# Altium schematic sheet system_electric_diagram_#1.SchDoc
size A4
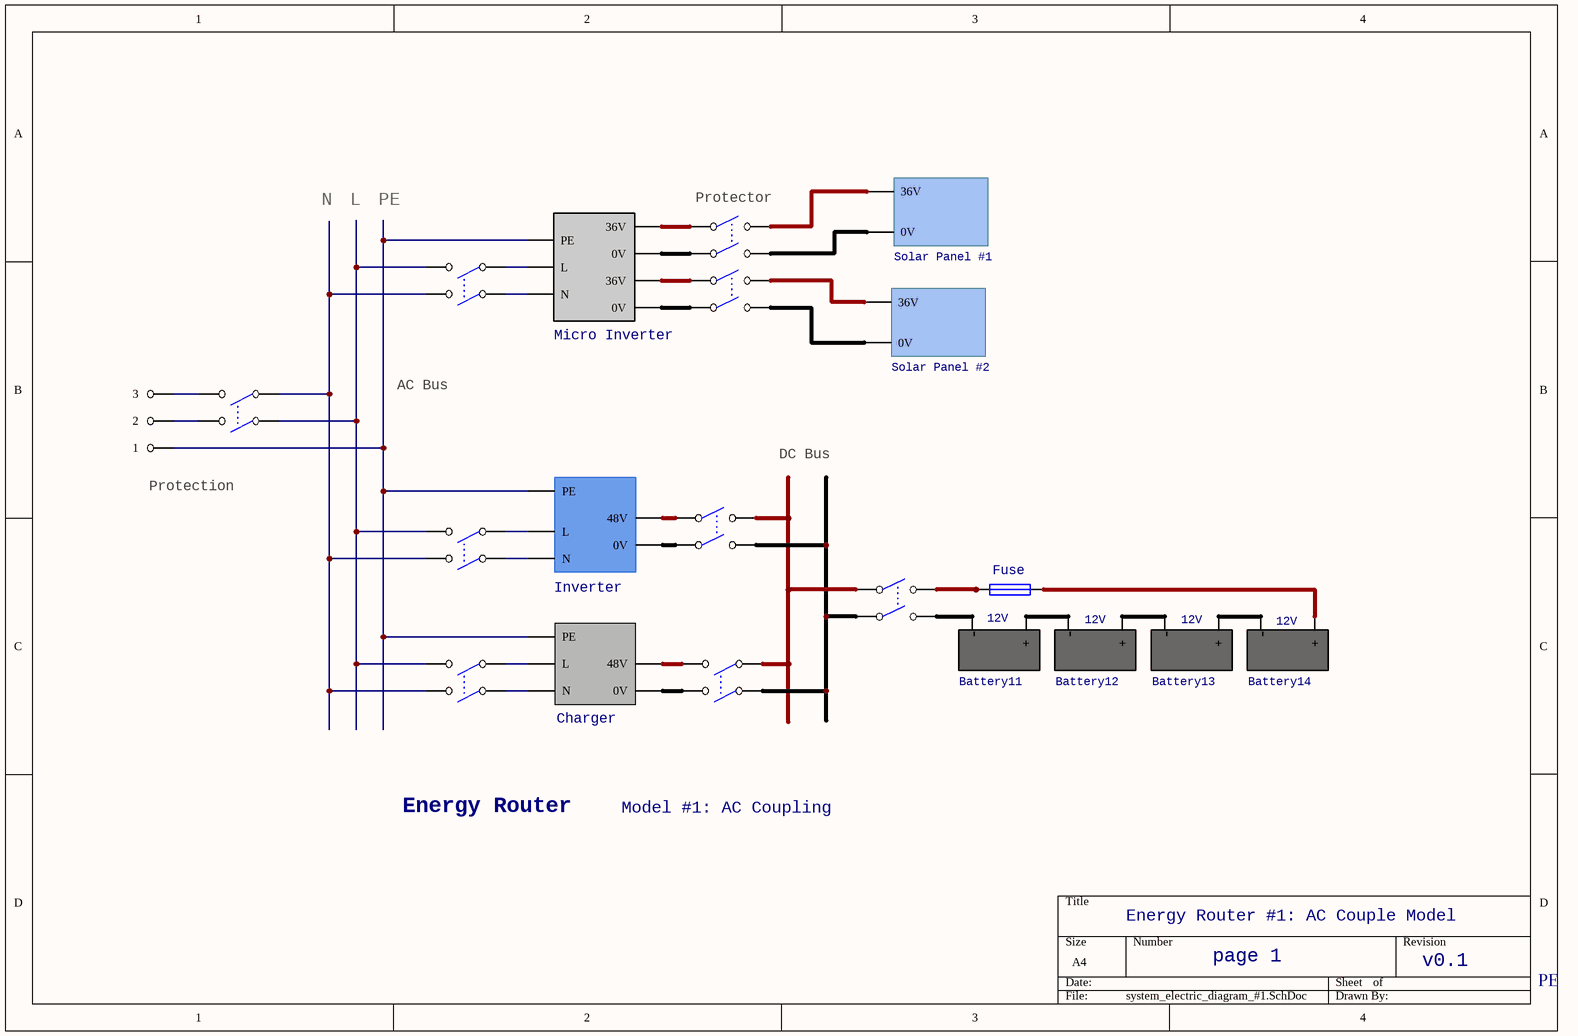
[diagram p0: system_electric_diagram_#1.SchDoc]

## Parts
Battery11  12V
Battery12  12V
Battery13  12V
Battery14  12V
F11  Fuse  [FUSE1]
JP01  3 HEADER  (value not drawn)
K2  Switch  (value not drawn)
K3  Switch  (value not drawn)
K4  Switch  (value not drawn)
K5  Switch  (value not drawn)
K6  Switch  (value not drawn)
K7  Switch  (value not drawn)
K10  Switch  (value not drawn)
K11  Switch  (value not drawn)
K12  Switch  (value not drawn)
U1  Micro Inverter
U2  Inverter
U3  Charger
U4  Solar Panel #1
U5  Solar Panel #2

## Nets
NetBattery11_1: Battery11.1(-) K12.4
NetBattery11_2: Battery11.2(+) Battery12.1(-)
NetBattery12_2: Battery12.2(+) Battery13.1(-)
NetBattery13_2: Battery13.2(+) Battery14.1(-)
NetBattery14_2: Battery14.2(+) F11.2
NetF11_1: F11.1 K12.2
NetJP01_1: JP01.1 U1.3(PE) U2.3(PE) U3.3(PE)
NetJP01_2: JP01.2 K10.2
NetJP01_3: JP01.3 K10.4
NetK2_1: K2.1 U2.1(N)
NetK2_2: K2.2 K3.2 K10.3 K11.2
NetK2_3: K2.3 U2.2(L)
NetK2_4: K2.4 K3.4 K10.1 K11.4
NetK3_1: K3.1 U3.1(N)
NetK3_3: K3.3 U3.2(L)
NetK4_1: K4.1 U1.7(36V)
NetK4_2: K4.2 U4.2(36V)
NetK4_3: K4.3 U1.6(0V)
NetK4_4: K4.4 U4.1(0V)
NetK5_1: K5.1 U1.5(36V)
NetK5_2: K5.2 U5.2(36V)
NetK5_3: K5.3 U1.4(0V)
NetK5_4: K5.4 U5.1(0V)
NetK6_1: K6.1 U2.5(48V)
NetK6_2: K6.2 K7.3 K12.1
NetK6_3: K6.3 U2.4(0V)
NetK6_4: K6.4 K7.1 K12.3
NetK7_2: K7.2 U3.4(0V)
NetK7_4: K7.4 U3.5(48V)
NetK11_1: K11.1 U1.1(N)
NetK11_3: K11.3 U1.2(L)

## Notes on the sheet
- N
- L
- PE
- (near K4) Protector
- AC Bus
- (near JP01) Protection
- DC Bus
- Energy Router
- Model #1: AC Coupling
- Energy Router #1: AC Couple Model
- page 1
- v0.1

## Library data of the parts
Battery11-Battery14 = 1_BAT_12V
JP01 = 3 HEADER: 3 Pin Header
K2-K7 K10-K12 = SW-DPST
U1 = 11_Micro_Inverter_2
U2 = 4_Inverter
U3 = 5_Charger_48V
U4 U5 = 10_Solar_Panel_36V